# EasyEDA schematic Wiring Diagram_2020-10-04.json
TITLE: Complete Device Wiring Schematic; REV: 1.0; Date: 2020-10-04; Sheet: 1/1; Drawn By: mporeilly; Company: University of Calgary
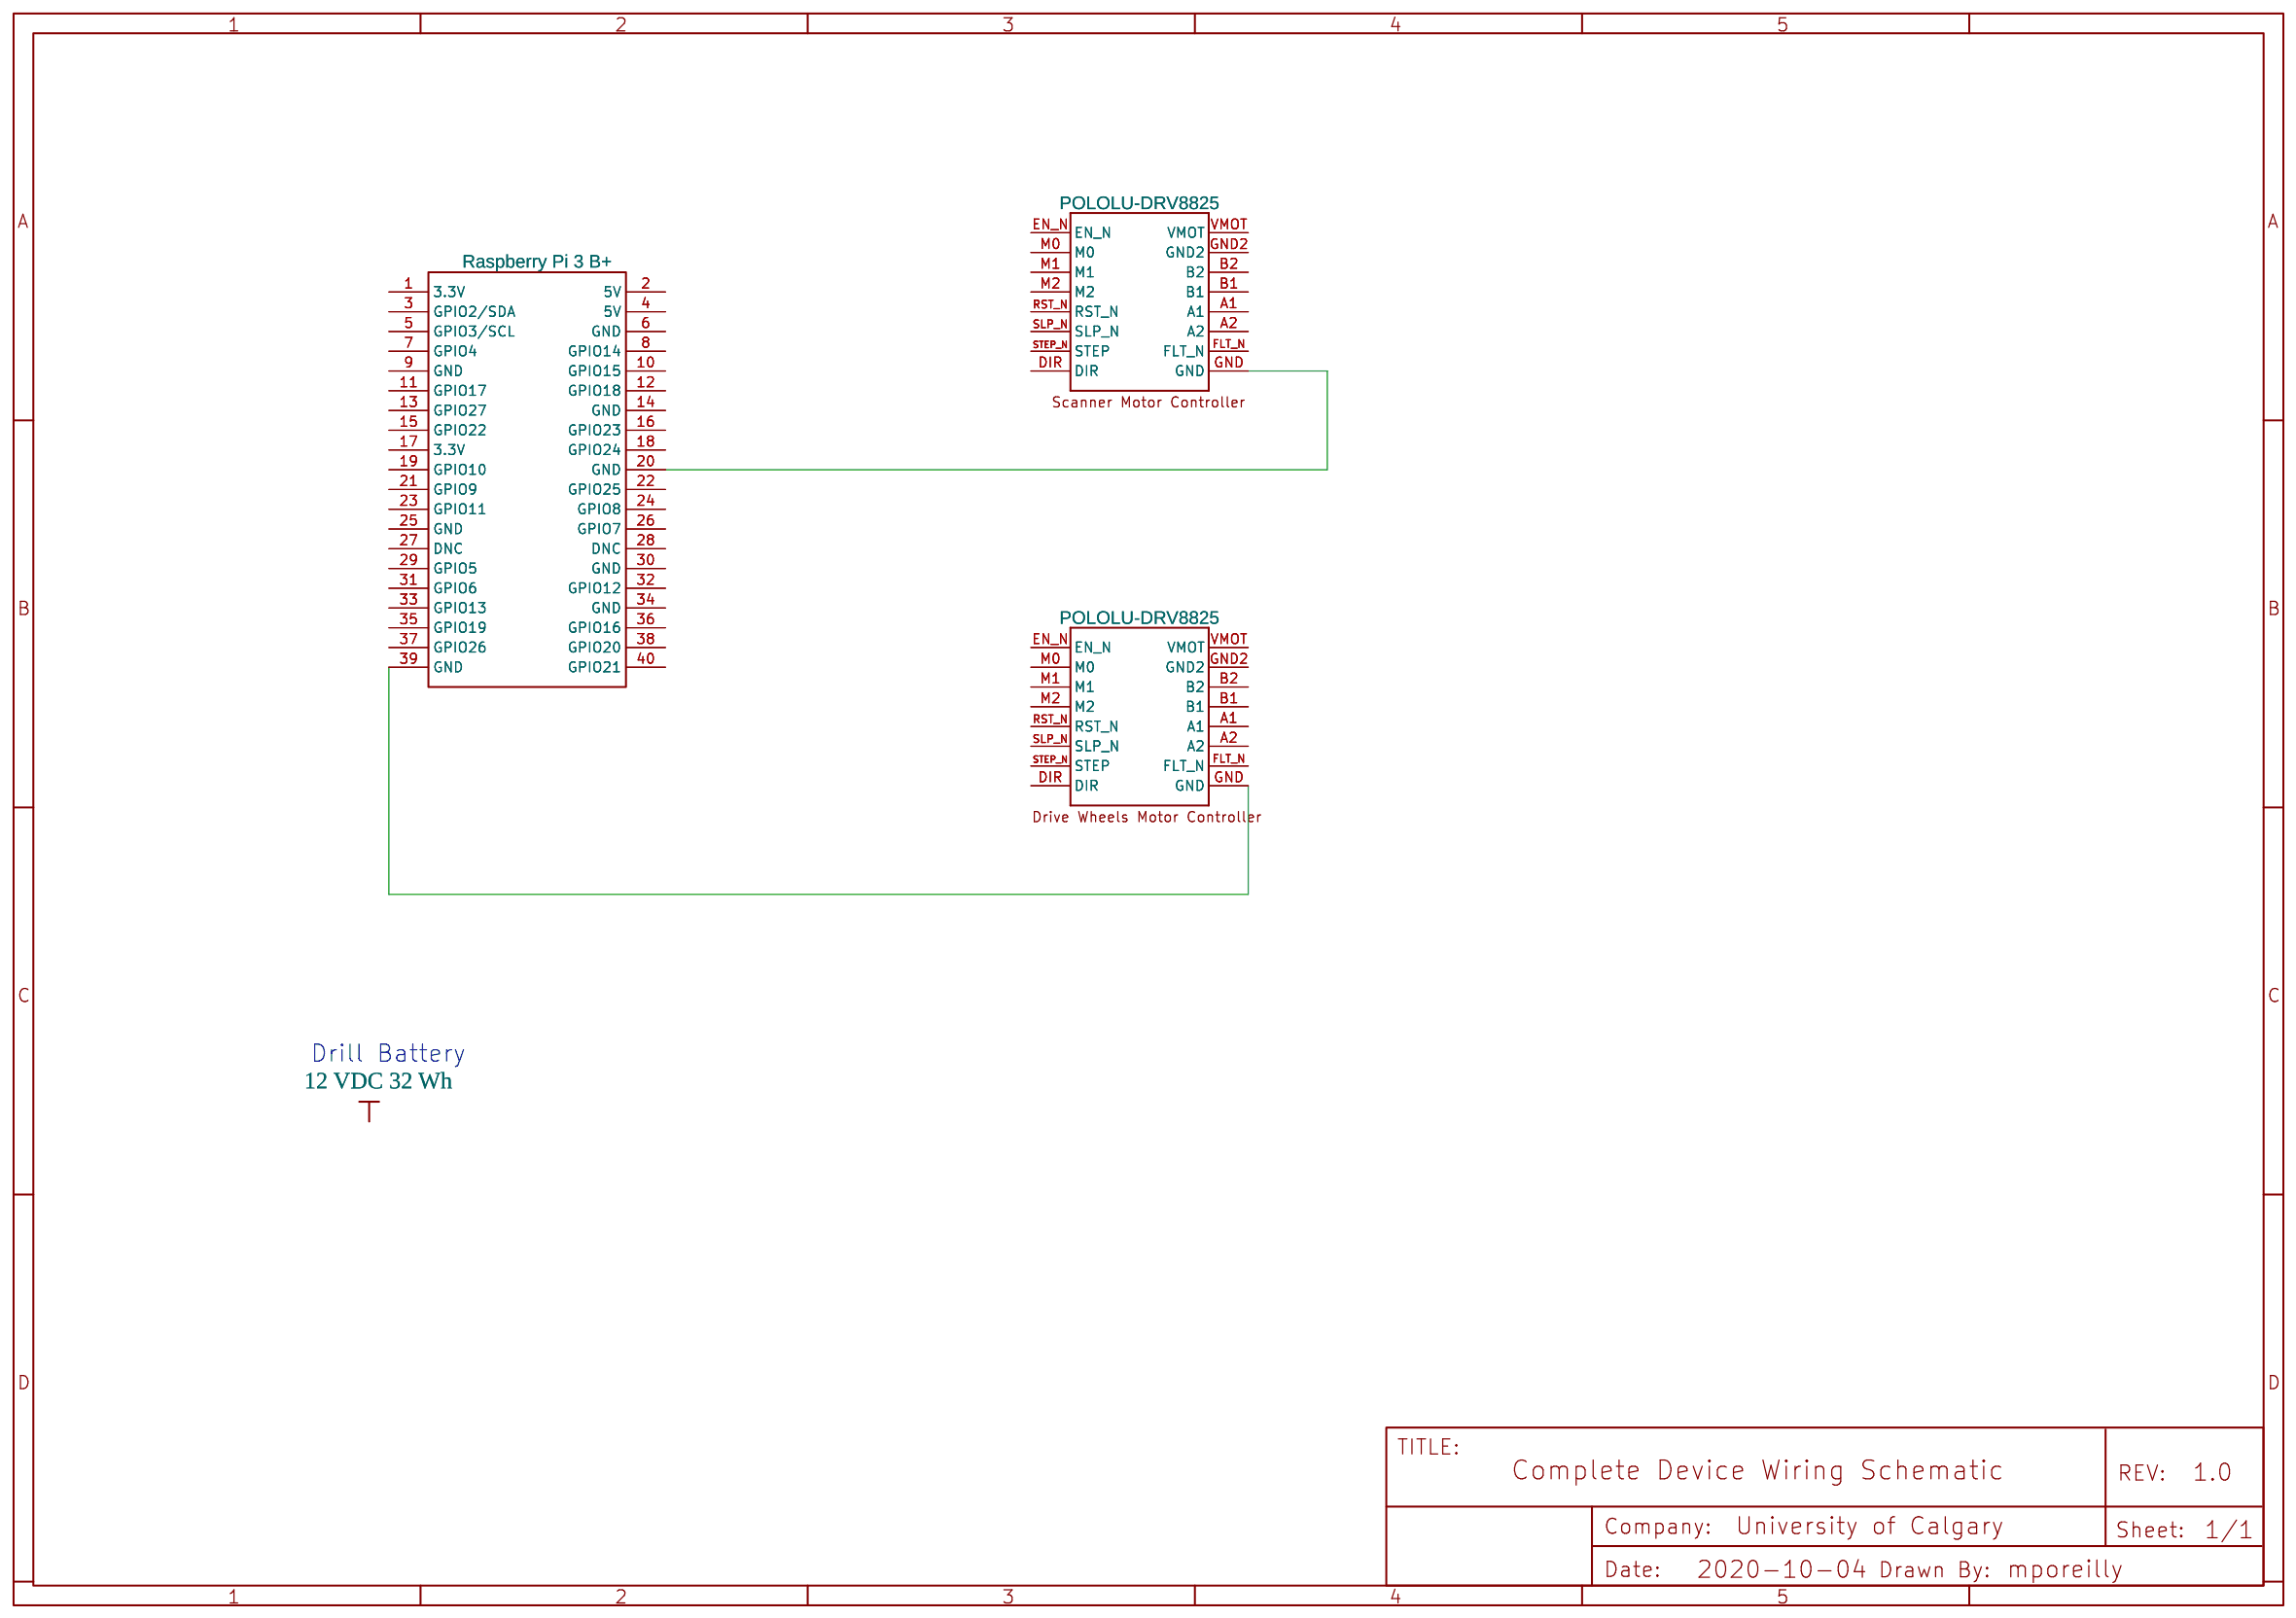
[diagram p0: schematic sheet]

## Parts
G$1  POLOLU-DRV8825  [POLOLU-DRV8825]
G$2  POLOLU-DRV8825  [POLOLU-DRV8825]
RPI1  Raspberry Pi 3 B+  [HDR-20X2/2.54]

## Library data of the parts
G$1 G$2 = POLOLU-DRV8825: Contributor: sagedot
RPI1 = Raspberry Pi 3 B+: Contributor: Sases; Supplier: Adafruit; Manufacturer: Raspberry Pi; Supplier Part: 3775; Manufacturer Part: Raspberry Pi 3 - Model B+ - 1.4GHz Cortex-A53 with 1GB RAM

## Nets
Net-(G$1-GND): G$1.GND RPI1.20(GND)
Net-(G$2-GND): G$2.GND RPI1.39(GND)

Not connected (* = marked no-connect by the designer): G$1 A1 A2 B1 B2 DIR EN_N FLT_N GND2 M0 M1 M2 RST_N SLP_N STEP_N(STEP) VMOT; G$2 A1 A2 B1 B2 DIR EN_N FLT_N GND2 M0 M1 M2 RST_N SLP_N STEP_N(STEP) VMOT; RPI1 1(3.3V) 2(5V) 3(GPIO2/SDA) 4(5V) 5(GPIO3/SCL) 6(GND) 7(GPIO4) 8(GPIO14) 9(GND) 10(GPIO15) 11(GPIO17) 12(GPIO18) 13(GPIO27) 14(GND) 15(GPIO22) 16(GPIO23) 17(3.3V) 18(GPIO24) 19(GPIO10) 21(GPIO9) 22(GPIO25) 23(GPIO11) 24(GPIO8) 25(GND) 26(GPIO7) 27(DNC) 28(DNC) 29(GPIO5) 30(GND) 31(GPIO6) 32(GPIO12) 33(GPIO13) 34(GND) 35(GPIO19) 36(GPIO16) 37(GPIO26) 38(GPIO20) 40(GPIO21)

## Notes on the sheet
- Drill Battery
